# EAGLE design Power_5V-8A_CurLim (EAGLE 7.7.0)
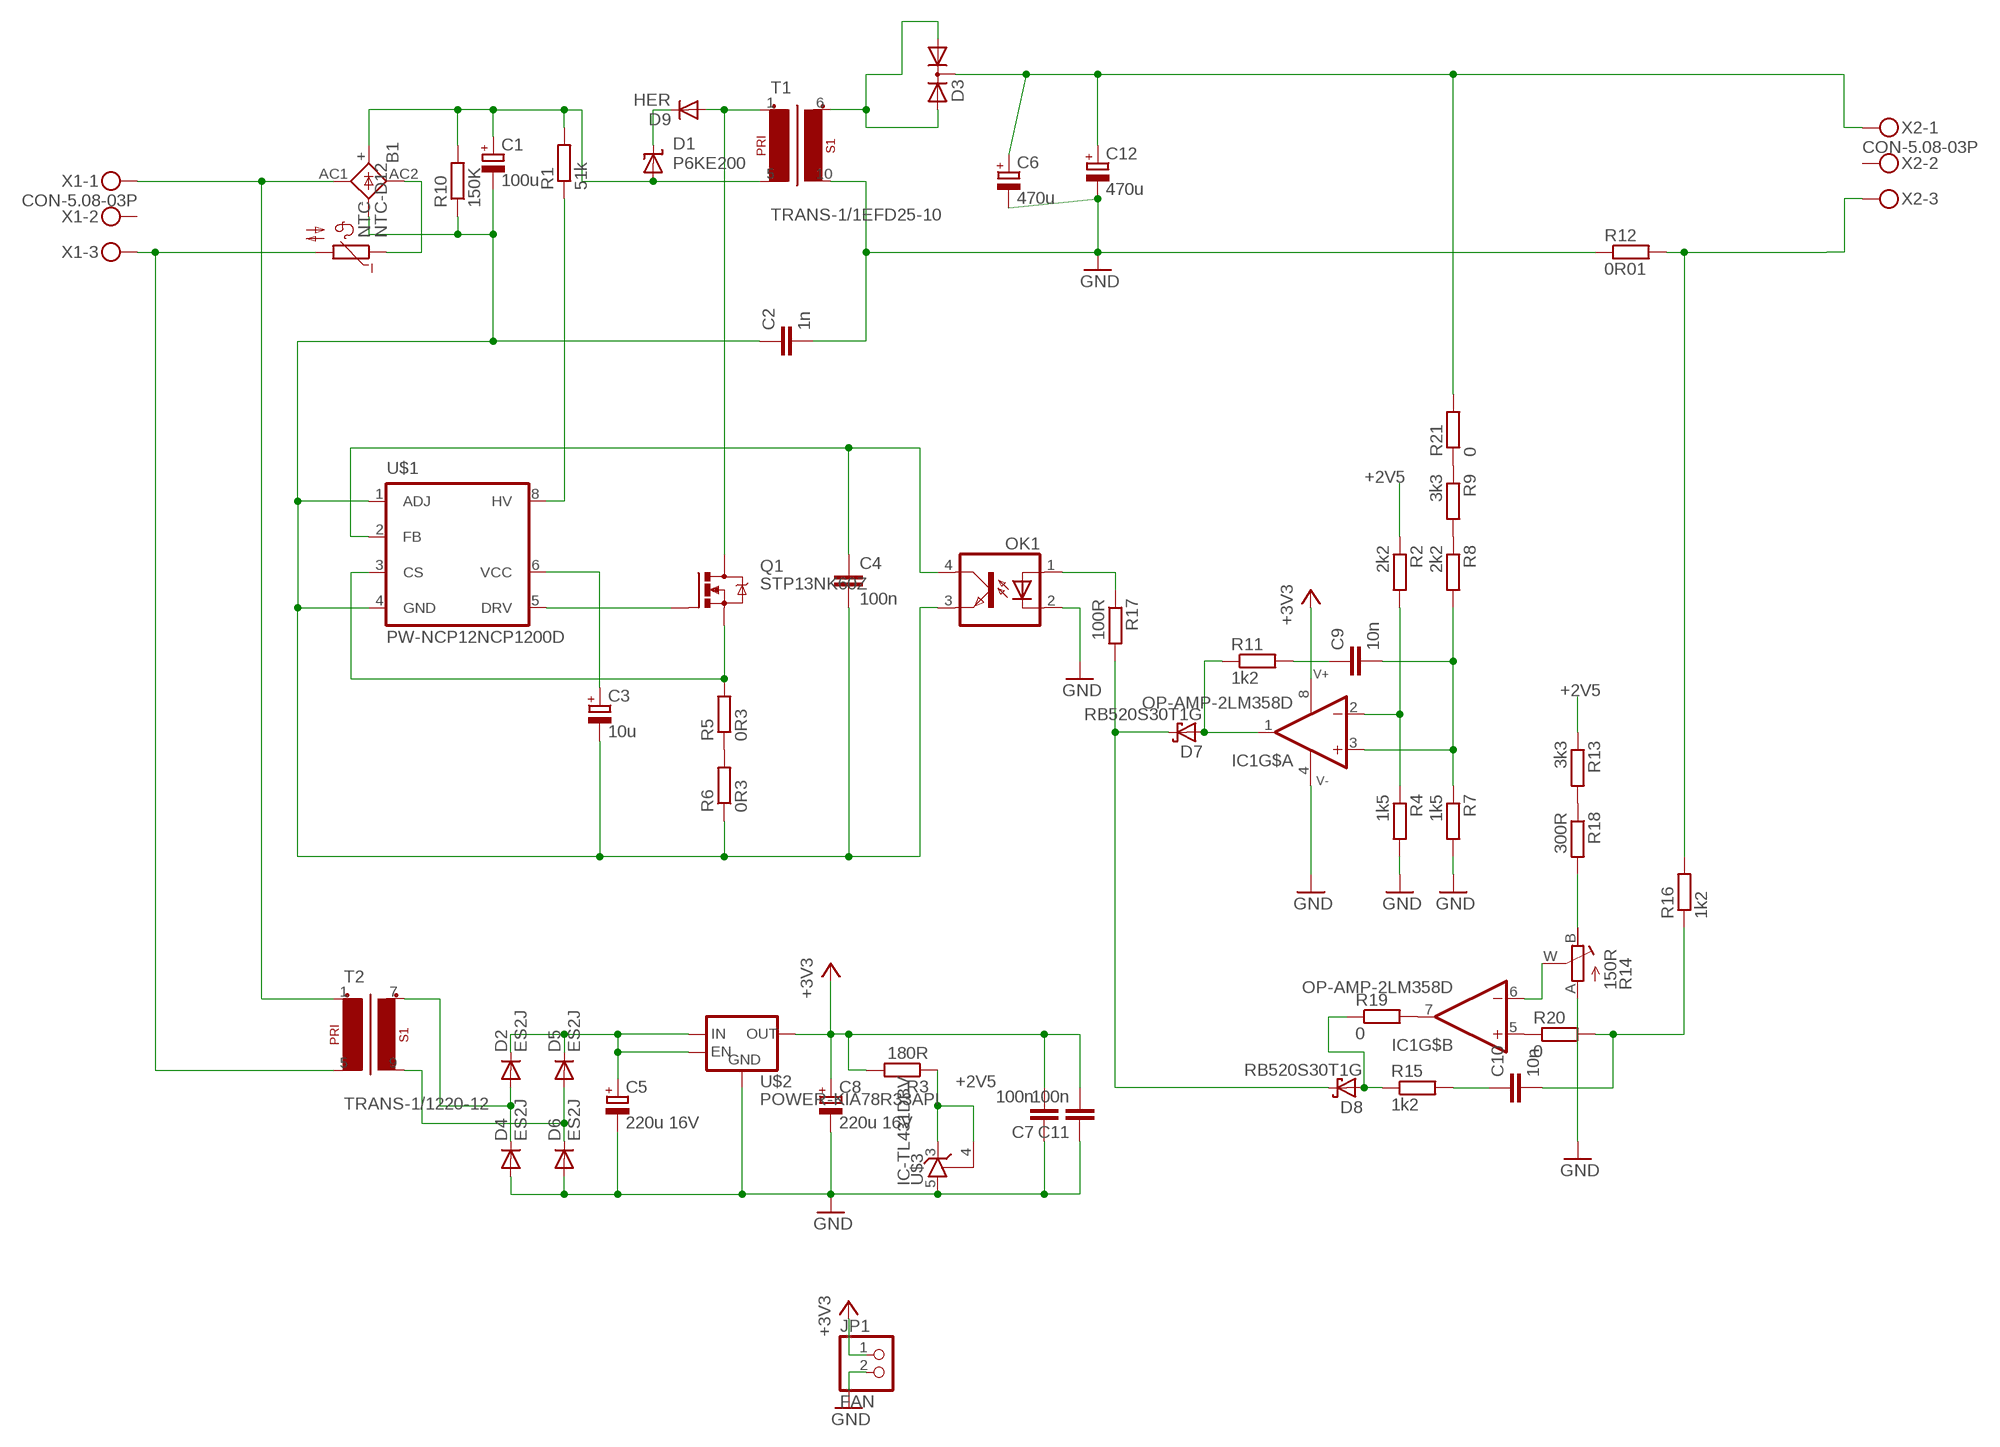
[diagram p0: schematic, sheet 1]

## Parts
B1  RECTIFIERKBL  [KBL]
C1  100u  CAP-POL_E25-10-C  [C_D25-G10-CLAMP]
C2  1n  CAP_C50-024X044  [C050-024X044]
C3  10u  CAP-POL_E5-5  [E5-5]
C4  100n  CAP_0805  [C0805]
C5  220u 16V  CAP-POL_E3.5-8  [E3,5-8]
C6  470u  CAP-POL_E5-10.5  [E5-10,5]
C7  100n  CAP_0805  [C0805]
C8  220u 16V  CAP-POL_E3.5-8  [E3,5-8]
C9  10n  CAP_1206  [C1206]
C10  10n  CAP_1206  [C1206]
C11  100n  CAP_0805  [C0805]
C12  470u  CAP-POL_E5-10.5  [E5-10,5]
D1  P6KE200  SUPRESSORDO-204AC  [DO15-12]
D2  ES2J  DIODE_ES1J  [DO214AC]
D3  DIODE-DUAL-CCTO-220V  [TO-220V]
D4  ES2J  DIODE_ES1J  [DO214AC]
D5  ES2J  DIODE_ES1J  [DO214AC]
D6  ES2J  DIODE_ES1J  [DO214AC]
D7  RB520S30T1G  DIODE-SH_SOD523  [SOD523]
D8  RB520S30T1G  DIODE-SH_SOD523  [SOD523]
D9  HER  DIODE_DO-201  [DO201-15]
IC1  OP-AMP-2LM358D  [SO8]
JP1  FAN  PINHD-1X2  [1X02]
NTC  NTC-D12  [NTC-D12]
OK1  OPTOTRANSPC817  [DIL04]
Q1  STP13NK60Z  FET-NTO-220  [TO-220V]
R1  51k  R_SQP-5  [SQP-5]
R2  2k2  R_1206  [R1206]
R3  180R  R_1206  [R1206]
R4  1k5  R_1206  [R1206]
R5  0R3  R_KNP-100B  [KNP-100B]
R6  0R3  R_KNP-100B  [KNP-100B]
R7  1k5  R_1206  [R1206]
R8  2k2  R_1206  [R1206]
R9  3k3  R_1206  [R1206]
R10  150K  R_MF-0125  [MF-0125]
R11  1k2  R_1206  [R1206]
R12  0R01  R_2512  [R2512]
R13  3k3  R_1206  [R1206]
R14  150R  R_POTTURN-X  [RJ9W]
R15  1k2  R_1206  [R1206]
R16  1k2  R_1206  [R1206]
R17  100R  R_1206  [R1206]
R18  300R  R_1206  [R1206]
R19  0  R_0805  [R0805]
R20  0  R_0805  [R0805]
R21  0  R_0805  [R0805]
T1  TRANS-1/1EFD25-10  [EFD25_10PIN]
T2  TRANS-1/1220-12  [32.5-27.5-27.5]
U$1  PW-NCP12NCP1200D  [SO8]
U$2  POWER-KIA78R33API  [TO-220/4]
U$3  IC-TL431DBV  [SOT23-5L]
X1  CON-5.08-03P  [MKDSN1,5/3-5,08]
X2  CON-5.08-03P  [MKDSN1,5/3-5,08]

## Nets
+2V5: R2.1 R3.1 R13.1 U$3.3(C) U$3.4(R)
+3V3: C7.2 C8.+ C11.2 IC1.8(G$PWR:V+) JP1.1 R3.2 U$2.O(OUT)
GND: C2.2 C5.- C6.- C7.1 C8.- C11.1 C12.- D4.A D6.A IC1.4(G$PWR:V-) JP1.2 OK1.2(C) R4.2 R7.2 R12.1 R14.A T1.10(S1-2) U$2.G(GND) U$3.5(A)
N$1: NTC.2 T2.5(P1-2) X1.3
N$2: B1.AC1(AC2) T2.1(P1-1) X1.1
N$3: B1.AC2(AC1) NTC.1
N$4: R5.1 R6.2
N$5: B1.- C1.- C2.1 C3.- C4.2 OK1.3(EMIT) R6.1 R10.1 U$1.1(ADJ) U$1.4(GND)
N$6: B1.+ C1.+ D1.A R1.2 R10.2 T1.5(P1-2)
N$7: D1.C D9.C
N$8: D9.A Q1.2(D) T1.1(P1-1)
N$9: IC1.2(G$A:-IN) R2.2 R4.1
N$10: R1.1 U$1.8(HV)
N$11: Q1.1(G) U$1.5(DRV)
N$12: Q1.3(S) R5.2 U$1.3(CS)
N$13: R8.1 R9.2
N$14: C3.+ U$1.6(VCC)
N$15: C4.1 OK1.4(COL) U$1.2(FB)
N$17: D3.1(A1) D3.3(A2) T1.6(S1-1)
N$18: C6.+ C12.+ D3.2(C) R21.2 X2.1
N$19: D2.A D4.C T2.7(S1-1)
N$20: D5.A D6.C T2.9(S1-2)
N$28: C9.2 IC1.3(G$A:+IN) R7.1 R8.2
N$29: D7.A IC1.1(G$A:OUT) R11.1
N$30: C5.+ D2.C D5.C U$2.E(EN) U$2.I(IN)
N$31: C9.1 R11.2
N$32: IC1.6(G$B:-IN) R14.W(S)
N$33: D8.A R15.1 R19.1
N$34: C10.1 R15.2
N$35: C10.2 R16.1 R20.2
N$36: R12.2 R16.2 X2.3
N$37: OK1.1(A) R17.1
N$38: R13.2 R18.1
N$39: D7.C D8.C R17.2
N$40: R14.B(E) R18.2
N$41: IC1.7(G$B:OUT) R19.2
N$42: IC1.5(G$B:+IN) R20.1
N$43: R9.1 R21.1
Unconnected: X1.2 X2.2

## Library data of the parts
B1 = Namenlos:RECTIFIER: DIOTEC RECTIFIER
C1 C3 C5 C6 C8 C12 = Namenlos:CAP-POL_
C2 C4 C7 C9-C11 = Namenlos:CAP_
D1 = Namenlos:SUPRESSOR
D2 D4-D6 D9 = Namenlos:DIODE_
D3 = Namenlos:DIODE-DUAL-CC
D7 D8 = Namenlos:DIODE-SH_
IC1 = Namenlos:OP-AMP-2
JP1 = pinhead:PINHD-1X2: PIN HEADER
NTC = Namenlos:NTC-D12
OK1 = Namenlos:OPTOTRANS: SHARP OPTO COUPLER; MPN: PC817X4J000F; OC_FARNELL: 9707727; OC_NEWARK: 97K7059
Q1 = Namenlos:FET-N
R1-R13 R15-R21 = Namenlos:R_
R14 = Namenlos:R_POT
T1 T2 = Namenlos:TRANS-1/1
U$1 = Namenlos:PW-NCP12*
U$2 = Namenlos:POWER-KIA78R33API
U$3 = Namenlos:IC-TL431
X1 X2 = Namenlos:CON-5.08-03P: MKDSN 1,5/ 3-5,08 Printklemme Nennstrom: 13,5 A Nennspannung: 250 V Rastermaß: 5,08 mm Polzahl: 3 Anschlussart: Schraubanschluss Montage: Löten Anschlussrichtung Leiter/Platine: 0 ° Artikelnummer: 1729131 Source: http://eshop.phoenixcontact.com .. 1729131.pdf

## Board
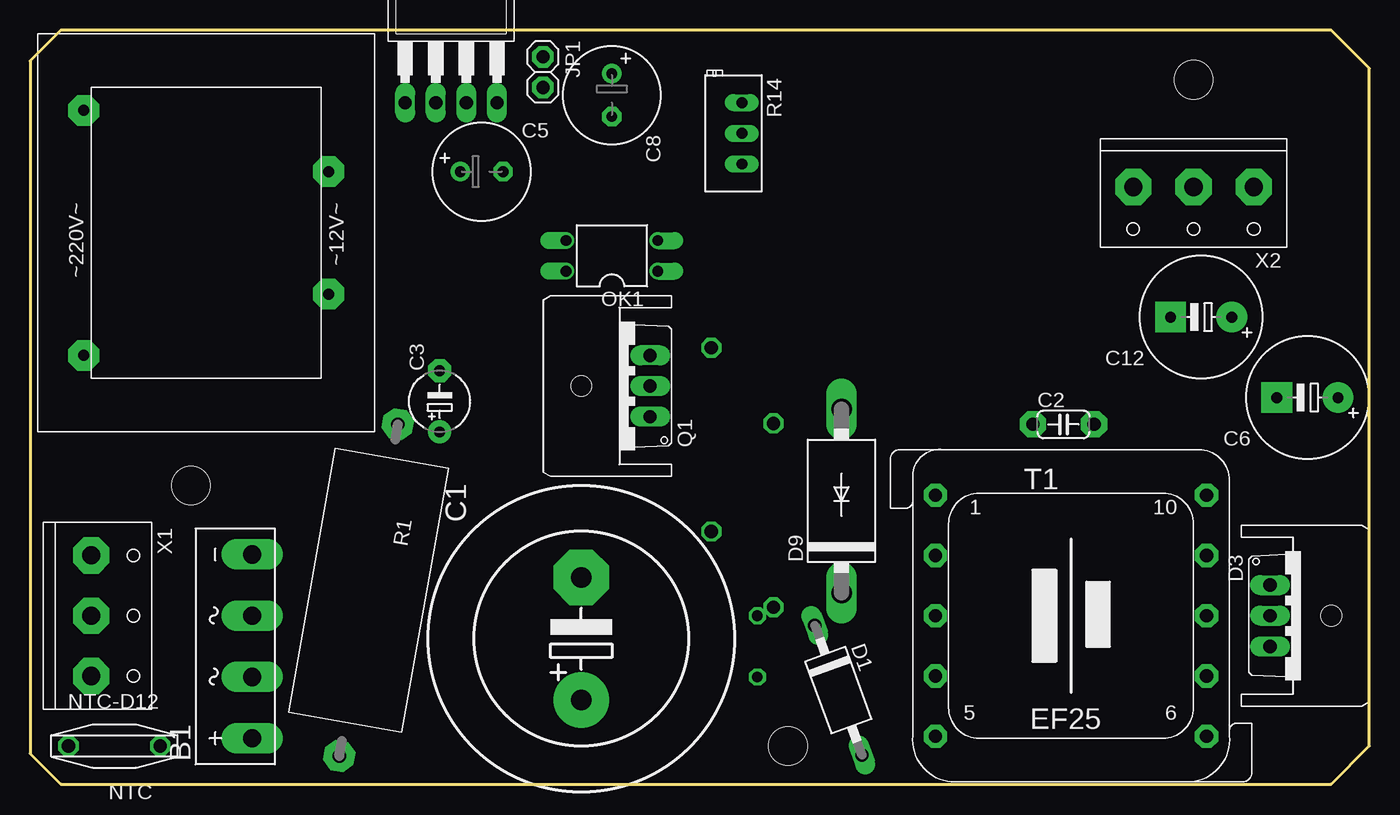
[diagram p1: board, top side]
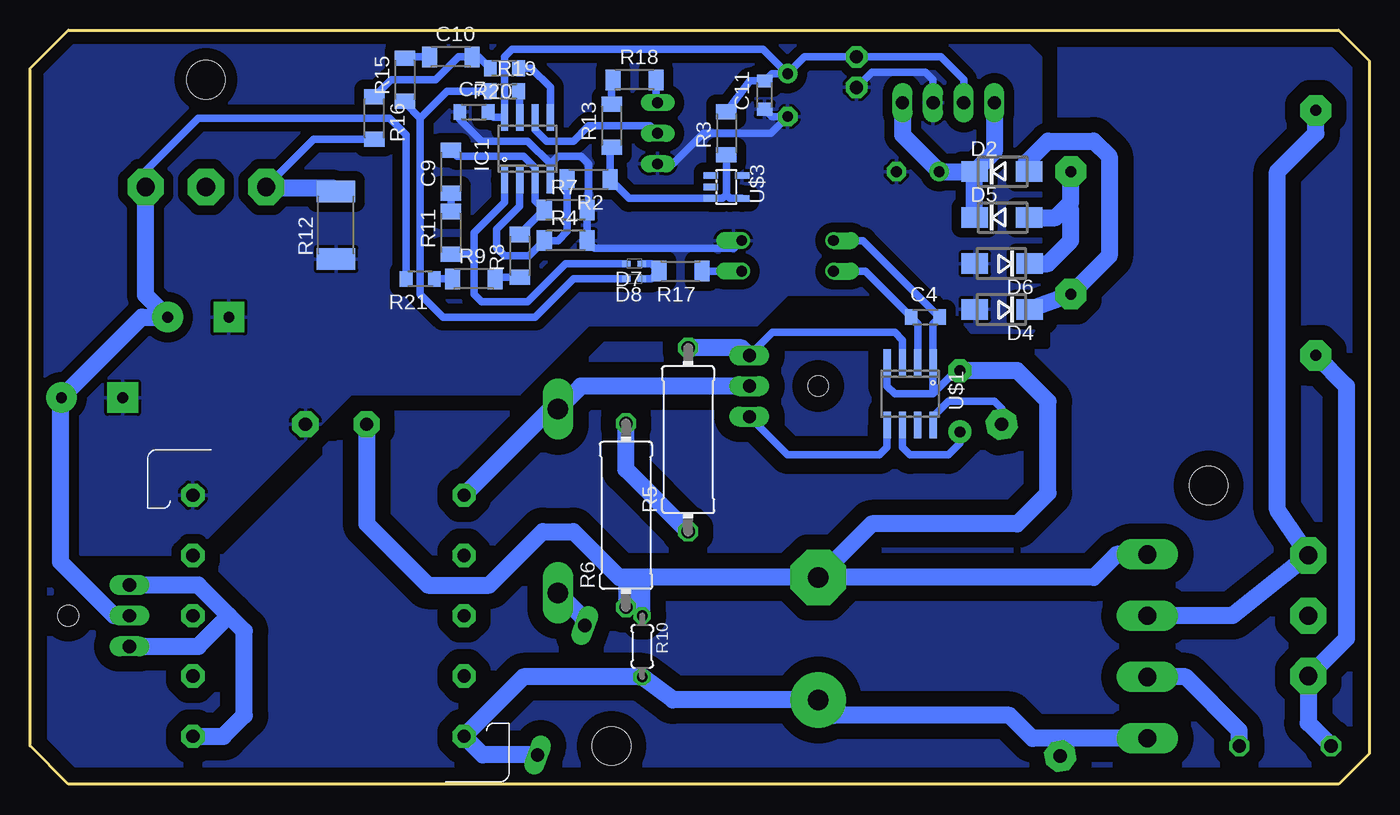
[diagram p2: board, bottom side, seen from below]

Size 111.11 x 62.53 mm. Coordinates in mm from the lower left corner, seen from the top.
Outline: 0,59.99 0,2.54 2.54,0 107.93,0 111.11,3.17 111.11,59.36 107.93,62.53 2.54,62.53 0,59.99
Copper layers (1*16): Top 0.035mm / dielectric 1.5mm / Bottom 0.035mm
Design rules "EagleDesignRules": minimum track width 0.2mm, minimum drill 0.3mm, track to track 0.2mm, track to pad 0.2mm, pad to pad 0.2mm, via to via 0.2mm, smd to smd 0.2mm, copper to edge 1mm, drill to drill 0.2mm, minimum pad ring 10mil, minimum via ring 8mil, stop-mask expansion 4mil, vias tented up to drill 0mil, thermal gap 0.25mm
Holes 3.2 mm at 13.34,24.77 96.52,58.42 62.87,3.17

### Footprints (pad centres in the part's own frame; a part is rotated, then mirrored left to right if it is on the bottom)
KBL = drill 1.5 pad 2.54 long: + -7.62,-1.27; - 7.62,-1.27; AC1 2.54,-1.27; AC2 -2.54,-1.27
C_D25-G10-CLAMP = drill 1.7 pad 4.597: + -5.08,0 | drill 1.7 pad 4.597 octagon: - 5.08,0
C050-024X044 = drill 1.1 pad 2.184 octagon: 1 -2.54,0; 2 2.54,0
E5-5 = drill 0.9 pad 1.905: + -2.54,0 | drill 0.9 pad 1.905 octagon: - 2.54,0
C0805 = smd 1.05 x 1.3: 1 -1.175,0; 2 1.175,0
E3,5-8 = drill 0.9 pad 1.6: + -1.778,0 | drill 0.9 pad 1.6 octagon: - 1.778,0
E5-10,5 = drill 0.9 pad 2.54: + -2.54,0 | drill 0.9 pad 2.54 square: - 2.54,0
C1206 = smd 1.25 x 1.7: 1 -1.775,0; 2 1.775,0
DO15-12 = drill 1.1 pad 1.676 long: A 5.08,0; C -6.35,0
DO214AC = smd 2.2 x 1.7: A 2.25,0; C -2.285,0
TO-220V = drill 1.1 long: 1 -2.54,-2.54; 2 0,-2.54; 3 2.54,-2.54
SOD523 = smd 0.7 x 0.5: A 0.7,0; C -0.6,0
DO201-15 = drill 1.7 long: A 7.62,0; C -7.62,0
SO8 = smd 0.6 x 2.2: 1 -1.905,-2.6; 2 -0.635,-2.6; 3 0.635,-2.6; 4 1.905,-2.6; 5 1.905,2.6; 6 0.635,2.6; 7 -0.635,2.6; 8 -1.905,2.6
1X02 = drill 1.1 pad 1.778 octagon: 1 -1.27,0; 2 1.27,0
NTC-D12 = drill 1.1 pad 1.676 octagon: 1 -3.81,0; 2 3.81,0
DIL04 = drill 0.9 pad 1.27 offset: 1 -1.27,-3.81; 2 1.27,-3.81; 3 1.27,3.81; 4 -1.27,3.81
SQP-5 = drill 1.1 pad 2.54 octagon: 1 -13.97,0; 2 13.97,0
R1206 = smd 1.25 x 1.7: 1 -1.775,0; 2 1.775,0
KNP-100B = drill 1.1 octagon: 1 -7.62,0; 2 7.62,0
MF-0125 = drill 0.9 octagon: 1 -2.54,0; 2 2.54,0
R2512 = smd 1.8 x 3.2: 1 -2.8,0; 2 2.8,0
RJ9W = drill 0.9 long: A 2.54,0.635; B -2.54,0.635; W 0,0.635
R0805 = smd 1.05 x 1.3: 1 -1.175,0; 2 1.175,0
EFD25_10PIN = drill 1.1 pad 1.93 octagon: 1 -11.25,10; 2 -11.25,5; 3 -11.25,0; 4 -11.25,-5; 5 -11.25,-10; 6 11.25,-10; 7 11.25,-5; 8 11.25,0; 9 11.25,5; 10 11.25,10
32.5-27.5-27.5 = drill 0.9 pad 2.54 octagon: 1 -10.16,-10.16; 5 10.16,-10.16; 7 5.08,10.16; 9 -5.08,10.16
TO-220/4 = drill 1.1 long: E 3.81,-10.16; G 1.27,-10.16; I -3.81,-10.16; O -1.27,-10.16
SOT23-5L = smd 0.55 x 1.2: 1 -0.95,-1.3; 2 0,-1.3; 3 0.95,-1.3; 4 0.95,1.3; 5 -0.95,1.3
SK95-3M3_HOLE = hole 1.7: 0,3.175
MKDSN1,5/3-5,08 = drill 1.5 pad 3 octagon: 1 -5,0; 2 0,0; 3 5,0

### Placement (x,y rotation side)
B1  17.14,11.43 90 top
C1  45.72,12.06 90 top
C2  85.72,29.84 0 top
C3  33.97,31.75 90 top
C4  36.83,38.73 0 bottom
C5  37.47,50.8 0 top
C6  105.97,32.06 180 top
C7  74.3,55.75 0 bottom
C8  48.26,57.15 270 top
C9  76.2,50.8 90 bottom
C10  76.2,60.33 0 bottom
C11  50.16,57.15 90 bottom
C12  97.16,38.73 180 top
D1  67.27,7.2 290 top
D2  30.48,50.8 0 bottom
D3  105.41,13.97 270 top
D4  30.48,39.37 180 bottom
D5  30.48,46.99 0 bottom
D6  30.48,43.18 180 bottom
D7  60.96,43.18 180 bottom
D8  60.96,41.91 180 bottom
D9  67.31,23.5 90 top
IC1  69.85,52.7 0 bottom
JP1  42.55,59.05 270 top
NTC  6.99,3.17 180 top
OK1  48.26,43.81 90 top
Q1  48.9,33.02 90 top
R1  28.08,16.09 260 top
R2  64.77,50.16 180 bottom
R3  53.34,53.98 90 bottom
R4  66.67,45.09 0 bottom
R5  56.52,28.57 90 bottom
R6  61.67,22.3 90 bottom
R7  66.67,47.62 0 bottom
R8  70.48,43.81 90 bottom
R9  74.3,41.91 0 bottom
R10  60.33,11.43 270 bottom
R11  76.2,45.72 90 bottom
R12  85.72,46.35 90 bottom
R13  62.87,54.61 90 bottom
R14  58.42,53.98 270 top
R15  80.01,58.42 90 bottom
R16  82.55,55.24 270 bottom
R17  57.15,42.55 180 bottom
R18  60.96,58.42 0 bottom
R19  71.75,57.47 0 bottom
R20  71.75,59.37 180 bottom
R21  78.74,41.91 180 bottom
T1  86.36,13.97 0 top
T2  14.61,45.72 270 top
U$1  38.1,32.38 180 bottom
U$2  34.92,66.67 0 top
U$3  53.34,49.53 270 bottom
U$4  [SK95-3M3_HOLE]  48.9,33.02 90 top
U$5  [SK95-3M3_HOLE]  104.78,13.97 270 top
X1  5.08,13.97 270 top
X2  96.52,49.53 180 top

### Tracks (layer width: path | path; a pad name or v marks a point on that pad's centre or on a via)
+2V5
  Bottom 0.61: 53.34,48.9 53.66,48.58 U$3.3 61.41,48.58 R2.1 62.99,52.7 R13.1 | 53.34,48.9 R3.1 | U$3.4 53.02,48.58 53.34,48.9
+3V3
  Bottom 0.61: C8.+ 49.56,58.93 C11.2 51.4,58.33 R3.2 | C7.2 72.67,55.3 IC1.8 71.75,60.33 71.12,60.96 50.29,60.96 C8.+ | U$2.O 33.66,58.42 35.56,60.33 JP1.1 46.86,60.33 C8.+
GND
  Bottom 0.61: C11.1 49.56,55.37 C8.- 49.66,53.98 55.24,53.98 57.78,51.44 R14.A | OK1.2 52.7,44.45 64.27,44.45 R4.2 R7.2 64.77,47.76 64.77,51.44 65.41,52.07 67.31,52.07 67.94,51.44 | 67.94,51.44 69.85,53.34 73.66,53.34 75.47,55.15 C7.1 | IC1.4 67.94,51.44 | U$2.G 36.2,58.42 36.83,59.05 41.27,59.05 JP1.2
  pour Bottom (isolate 0.813): 111.12,19.05 97.79,19.05 84.45,32.38 70.48,32.38 64.77,38.1 50.8,38.1 48.26,40.64 35.56,40.64 33.02,37.47 27.94,37.47 27.3,38.1 27.3,60.33 29.21,62.23 107.95,62.23 111.12,59.05
N$1
  Bottom 1.422: T2.5 1.91,33.02 1.91,12.06 5.08,8.89 | 5.08,8.89 X1.3 | 5.08,8.89 5.08,5.08 NTC.2
N$2
  Bottom 1.422: T2.1 4.45,53.98 7.62,50.8 7.62,22.78 X1.1 11.35,13.97 B1.AC1
N$3
  Bottom 1.422: NTC.1 10.79,4.45 15.24,8.89 B1.AC2
N$4
  Bottom 1.422: R5.1 61.67,26.11 R6.2
N$5
  Bottom 0.61: 40.01,35.53 U$1.4 40.01,33.02 39.37,32.38 36.2,32.38 | OK1.3 42.01,45.09 C4.2 36.2,38.2 U$1.1 36.2,32.38 | 36.2,32.38 34.29,34.29 C3.-
  Bottom 1.422: B1.- 20.95,19.05 22.86,17.14 C1.- | C3.- 29.21,34.29 26.67,31.75 26.67,24.13 29.21,21.59 41.27,21.59 C1.- | C1.- 60.33,17.14 | 60.33,17.14 61.59,17.14 | R6.1 61.59,14.76 61.59,17.14 | R10.1 60.33,17.14 | 61.59,17.14 62.23,17.14 65.72,20.64 66.04,20.95 68.58,20.95 73.03,16.51 78.11,16.51 83.19,21.59 C2.1
N$6
  Bottom 1.422: B1.+ 26.04,3.81 | 26.04,3.81 27.94,3.81 29.84,5.71 44.45,5.71 C1.+ 57.78,6.99 R10.2 70.19,8.89 T1.5 73.57,2.43 D1.A | R1.2 25.65,3.43 26.04,3.81
N$7
  Bottom 1.422: D1.C 65.24,13.8 D9.C
N$8
  Bottom 1.422: Q1.2 65.41,33.02 D9.A 67.97,31.11 T1.1
N$9
  Bottom 0.61: R2.2 66.55,45.85 67.31,45.09 R4.1 69.72,43.81 71.75,43.81 72.39,44.45 72.39,46.04 70.48,47.94 IC1.2
N$10
  Bottom 0.61: U$1.8 36.2,30.48 34.92,31.75 31.11,31.75 30.5,31.14 R1.1
N$11
  Bottom 0.61: Q1.1 48.26,27.3 40.64,27.3 40.01,27.94 U$1.5
N$12
  Bottom 0.61: U$1.3 38.73,36.82 39.37,37.47 49.53,37.47 Q1.3
  Bottom 1.422: Q1.3 52.07,36.2 R5.2
N$13
  Bottom 0.61: R8.1 72.39,42.04 R9.2
N$14
  Bottom 0.61: C3.+ 33.97,28.26 34.92,27.3 38.1,27.3 38.73,27.94 U$1.6
N$15
  Bottom 0.61: U$1.2 37.45,38.19 C4.1 41.81,42.55 OK1.4
N$17
  Bottom 1.422: T1.6 95.09,3.97 93.34,5.71 93.34,12.7 94.61,13.97 | 94.61,13.97 97.16,16.51 D3.1 | D3.3 97.16,11.43 94.61,13.97
N$18
  Bottom 0.61: R21.2 79.92,53.88 81.28,55.24 97.16,55.24 101.6,50.8 101.6,49.61 X2.1
  Bottom 1.422: X2.1 101.52,40.56 C12.+ 101.84,38.73 C6.+ 108.58,31.99 108.58,18.41 104.14,13.97 D3.2
N$19
  Bottom 1.422: D4.C T2.7 21.59,43.81 21.59,52.07 22.86,53.34 26.67,53.34 28.45,51.55 D2.A
N$20
  Bottom 1.422: D5.A 26.04,46.99 25.08,47.94 | 25.08,47.94 24.77,48.26 T2.9 | D6.C 26.67,43.18 24.77,45.09 24.77,47.62 25.08,47.94
N$28
  Bottom 0.61: R8.2 R7.1 69.22,48.39 IC1.3 69.22,51.12 70.17,52.07 75.69,52.07 C9.2
N$29
  Bottom 0.61: D7.A 66.67,43.18 69.85,40.01 73.66,40.01 74.3,40.64 74.3,43.81 | 74.3,43.81 74.3,45.72 71.75,48.26 IC1.1 | R11.1 74.42,43.95 74.3,43.81
N$30
  Bottom 1.422: D5.C D2.C | D2.C C5.+ 38.73,53.85 U$2.E | U$2.I 31.11,52.45 D2.C
N$31
  Bottom 0.61: R11.2 C9.1
N$32
  Bottom 0.61: R14.W 59.69,54.61 64.77,54.61 66.04,53.34 68.26,53.34 69.22,54.29 IC1.6
N$33
  Bottom 0.61: D8.A 66.04,41.91 69.22,38.73 76.83,38.73 78.74,40.64 78.74,53.98 78.74,55.24 | R19.1 76.52,57.47 78.74,55.24 | R15.1 80.01,56.52 78.74,55.24
N$34
  Bottom 0.61: C10.1 79.88,60.33 R15.2
N$35
  Bottom 0.61: R20.2 73.88,60.33 C10.2 75.56,60.33 77.47,58.42 81.15,58.42 R16.1
N$36
  Bottom 0.61: R16.2 87.58,53.47 X2.3
  Bottom 1.422: X2.3 91.44,49.45 86.02,49.45 R12.2
N$37
  Bottom 0.61: OK1.1 54.74,42.55 R17.1
N$38
  Bottom 0.61: R13.2 62.87,58.29 R18.1
N$39
  Bottom 0.61: D8.C 59.56,41.91 R17.2 59.56,43.18 D7.C
N$40
  Bottom 0.61: R18.2 59.19,56.65 R14.B
N$41
  Bottom 0.61: IC1.7 70.48,57.37 R19.2
N$42
  Bottom 0.61: IC1.5 67.94,57.78 69.53,59.37 R20.1
N$43
  Bottom 0.61: R9.1 R21.1
N$44
  pour Bottom (isolate 1.27, rank 2): 0,59.69 0,3.17 2.54,0.64 107.95,0.64 111.12,3.81 111.12,59.05 107.95,62.23 2.54,62.23